# EAGLE design console (EAGLE 8.0.2)
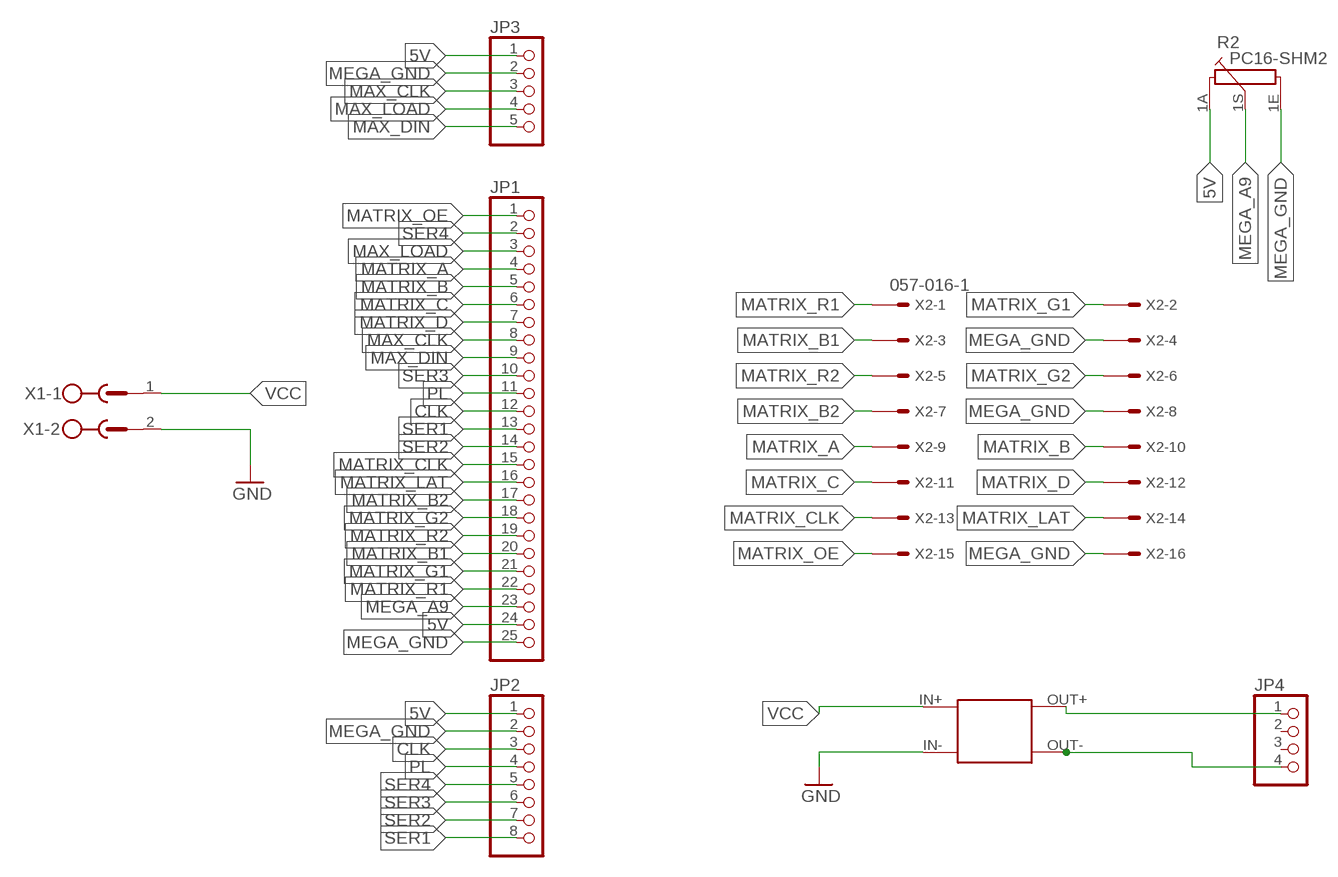
[diagram p0: schematic, sheet 1]

## Parts
JP1  PINHD-1X25  [1X25]
JP2  PINHD-1X8  [1X08]
JP3  PINHD-1X5  [1X05]
JP4  PINHD-1X4  [1X04]
R2  PC16-SHM2  [PC16-SHM2]
U$1  SPGRGL_DEV  [SPGRGL_PACK]
X1  MSTBV2  [MSTBV2]
X2  057-016-1  [057-016-1]

## Nets
5V: JP1.24 JP2.1 JP3.1 R2.1A
CLK: JP1.12 JP2.3
GND: U$1.IN- X1.2
MATRIX_A: JP1.4 X2.9
MATRIX_B: JP1.5 X2.10
MATRIX_B1: JP1.20 X2.3
MATRIX_B2: JP1.17 X2.7
MATRIX_C: JP1.6 X2.11
MATRIX_CLK: JP1.15 X2.13
MATRIX_D: JP1.7 X2.12
MATRIX_G1: JP1.21 X2.2
MATRIX_G2: JP1.18 X2.6
MATRIX_GND: JP4.4 U$1.OUT-
MATRIX_LAT: JP1.16 X2.14
MATRIX_OE: JP1.1 X2.15
MATRIX_R1: JP1.22 X2.1
MATRIX_R2: JP1.19 X2.5
MATRIX_VCC: JP4.1 U$1.OUT+
MAX_CLK: JP1.8 JP3.3
MAX_DIN: JP1.9 JP3.5
MAX_LOAD: JP1.3 JP3.4
MEGA_A9: JP1.23 R2.1S
MEGA_GND: JP1.25 JP2.2 JP3.2 R2.1E X2.4 X2.8 X2.16
PL: JP1.11 JP2.4
SER1: JP1.13 JP2.8
SER2: JP1.14 JP2.7
SER3: JP1.10 JP2.6
SER4: JP1.2 JP2.5
VCC: U$1.IN+ X1.1
Unconnected: JP4.2 JP4.3 R2.M1 R2.M2 R2.M3 R2.M4

## Library data of the parts
JP1 = pinhead:PINHD-1X25: PIN HEADER
JP2 = pinhead:PINHD-1X8: PIN HEADER
JP3 = pinhead:PINHD-1X5: PIN HEADER
JP4 = pinhead:PINHD-1X4: PIN HEADER
R2 = piher:PC16-SHM2: POTENTIOMETER single carbon potentiometer, 16 mm, S3ROH; OC_FARNELL: unknown; OC_NEWARK: unknown
U$1 = Spannungsregler:SPGRGL_DEV
X1 = con-phoenix-500:MSTBV2: PHOENIX; OC_FARNELL: unknown; OC_NEWARK: unknown
X2 = con-panduit:057-016-: CONNECTOR 10-pin series 057 contact pc board low profile headers; OC_FARNELL: unknown; OC_NEWARK: unknown

## Board
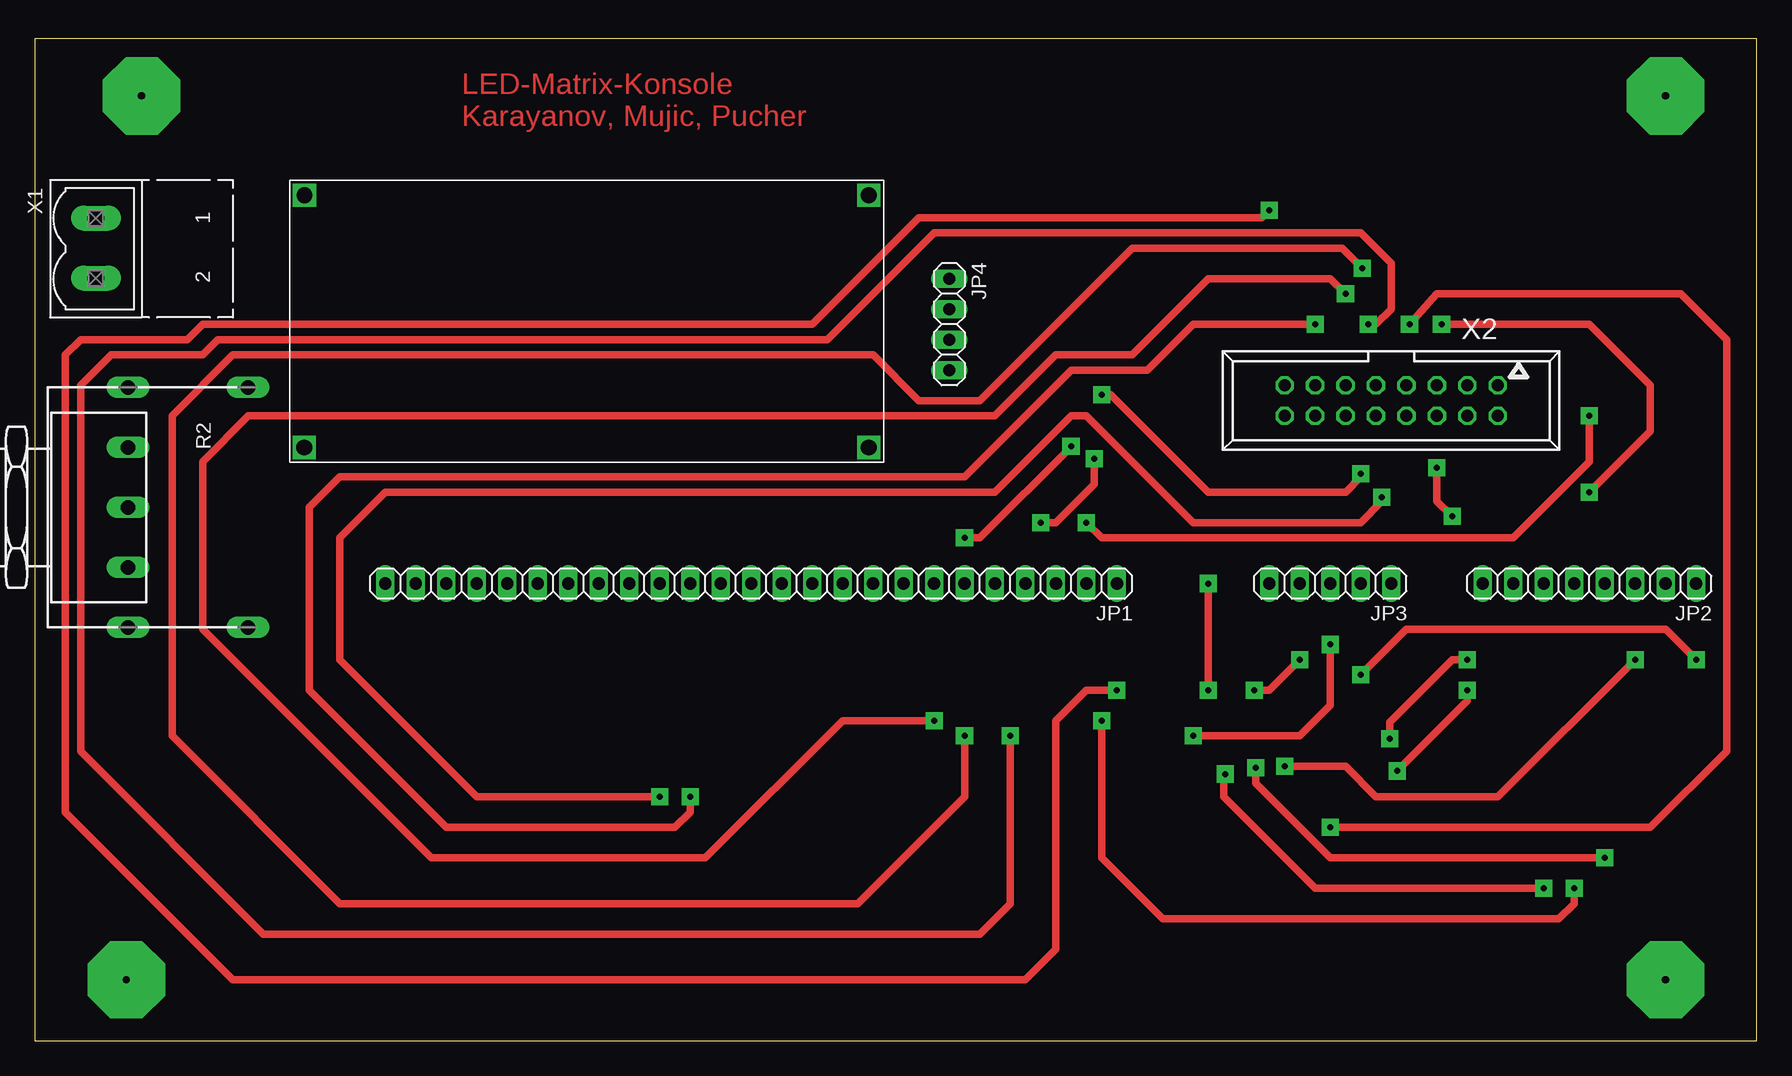
[diagram p1: board, top side]
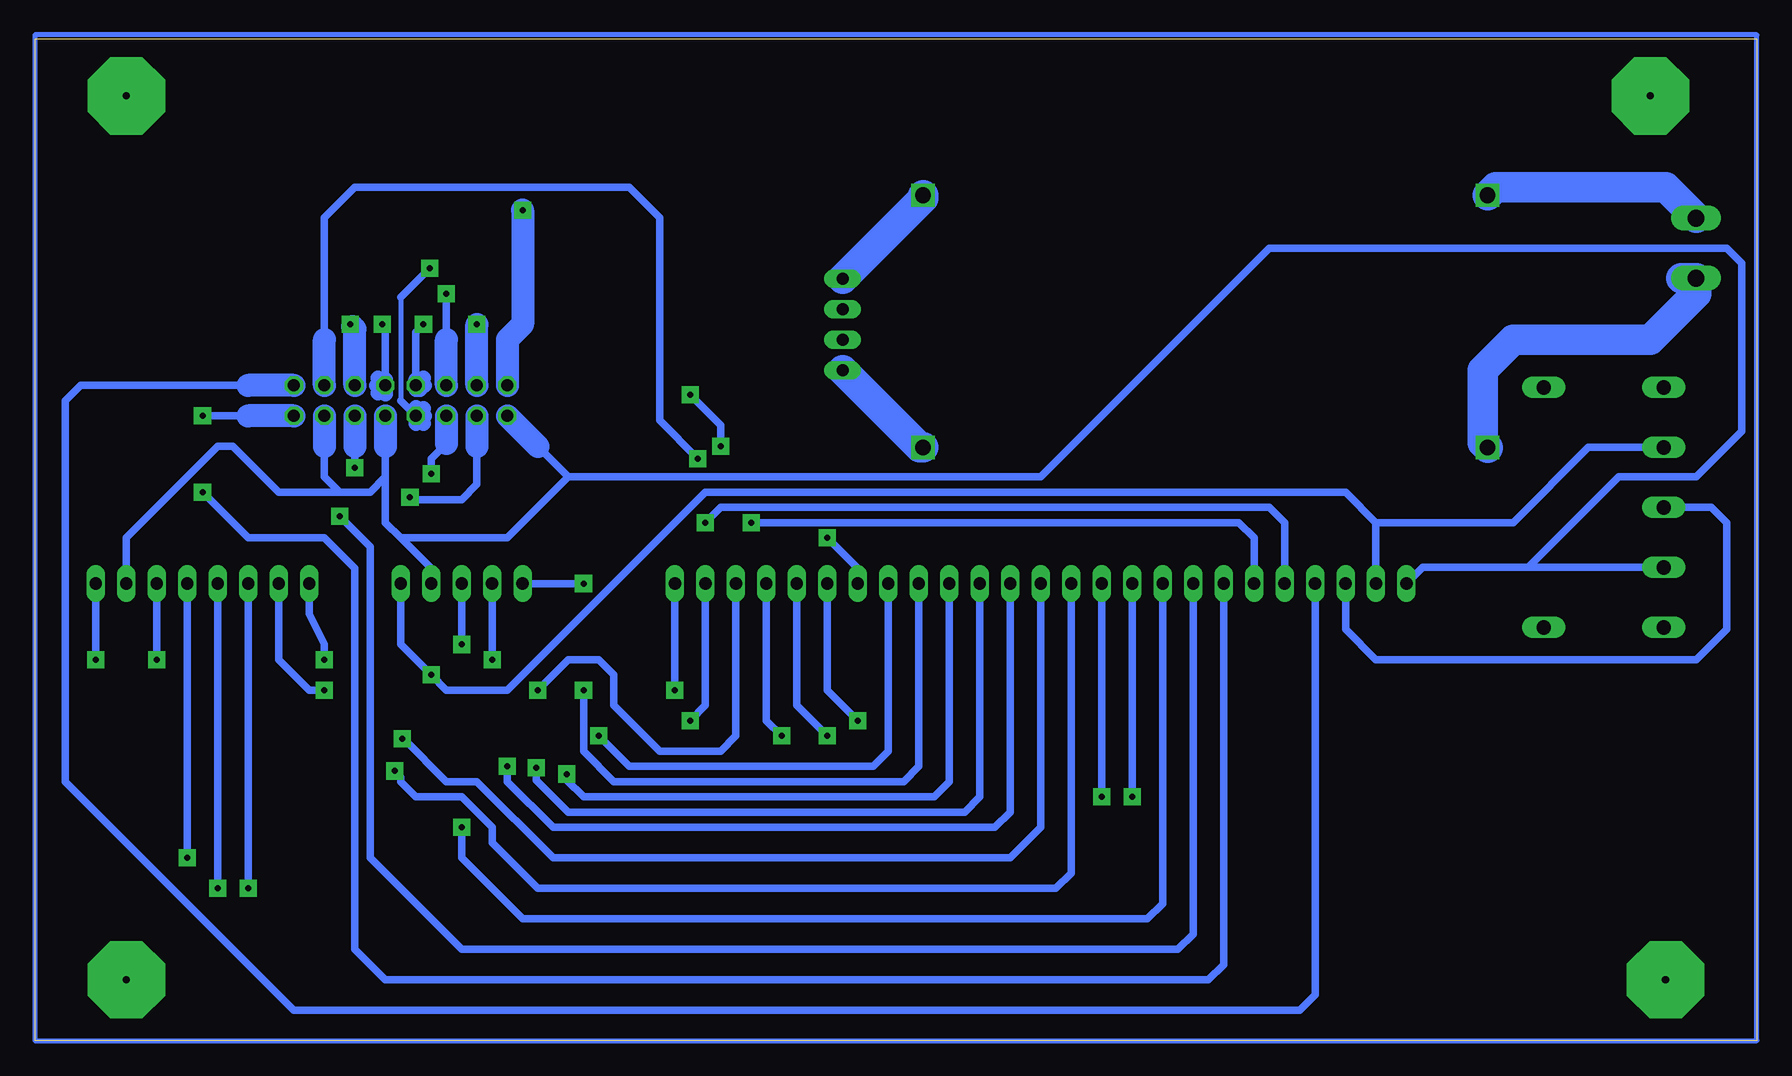
[diagram p2: board, bottom side, seen from below]

Size 143.49 x 83.49 mm. Coordinates in mm from the lower left corner, seen from the top.
Outline: 0,0 143.49,0 143.49,83.49 0,83.49 0,0
Copper layers (1*16): Top 0.035mm / dielectric 1.5mm / Bottom 0.035mm
Design rules "default": minimum track width 10mil, minimum drill 24mil, track to track 8mil, track to pad 8mil, pad to pad 8mil, via to via 8mil, smd to smd 8mil, copper to edge 40mil, drill to drill 8mil, minimum pad ring 10mil, minimum via ring 8mil, stop-mask expansion 4mil, vias tented up to drill 0mil, thermal gap 10mil

### Footprints (pad centres in the part's own frame; a part is rotated, then mirrored left to right if it is on the bottom)
1X25 = drill 1.016 long: 1 -29.21,0; 2 -26.67,0; 3 -24.13,0; 4 -21.59,0; 5 -19.05,0; 6 -16.51,0; 7 -13.97,0; 8 -11.43,0; 9 -8.89,0; 10 -6.35,0; 11 -3.81,0; 12 -1.27,0; 13 1.27,0; 14 3.81,0; 15 6.35,0; 16 8.89,0; 17 11.43,0; 18 13.97,0; 19 16.51,0; 20 19.05,0; 21 21.59,0; 22 24.13,0; 23 26.67,0; 24 29.21,0; 25 31.75,0
1X08 = drill 1.016 long: 1 -8.89,0; 2 -6.35,0; 3 -3.81,0; 4 -1.27,0; 5 1.27,0; 6 3.81,0; 7 6.35,0; 8 8.89,0
1X05 = drill 1.016 long: 1 -5.08,0; 2 -2.54,0; 3 0,0; 4 2.54,0; 5 5.08,0
1X04 = drill 1.016 long: 1 -3.81,0; 2 -1.27,0; 3 1.27,0; 4 3.81,0
PC16-SHM2 = drill 1.2 long: 1A -5,6.5; 1E 5,6.5; 1S 0,6.5; M1 -10,6.5; M2 10,6.5; M3 10,16.5; M4 -10,16.5
SPGRGL_PACK = drill 1.3 square: IN+ -23.262,10.762; IN- -23.27,-10.262; OUT+ 23.77,10.762; OUT- 23.77,-10.254
MSTBV2 = drill 1.397 long: 1 -2.5,0; 2 2.5,0
057-016-1 = drill 1 octagon: 1 -8.89,-1.27; 2 -8.89,1.27; 3 -6.35,-1.27; 4 -6.35,1.27; 5 -3.81,-1.27; 6 -3.81,1.27; 7 -1.27,-1.27; 8 -1.27,1.27; 9 1.27,-1.27; 10 1.27,1.27; 11 3.81,-1.27; 12 3.81,1.27; 13 6.35,-1.27; 14 6.35,1.27; 15 8.89,-1.27; 16 8.89,1.27

### Placement (x,y rotation side)
JP1  60.96,38.1 180 top
JP2  129.54,38.1 180 top
JP3  107.95,38.1 180 top
JP4  76.2,59.69 270 top
R2  1.27,44.45 270 top
U$1  45.72,59.69 0 top
X1  5.08,66.04 270 top
X2  113.03,53.34 180 top

### Tracks (layer width: path | path; a pad name or v marks a point on that pad's centre or on a via)
5V  (via drill 0.5 pad 1.42)
  Top 0.61: v110.49,30.48 114.3,34.29 135.89,34.29 v138.43,31.75
  Bottom 0.61: 31.75,43.18 JP1.24 | 31.75,43.18 34.29,45.72 87.63,45.72 104.14,29.21 109.22,29.21 v110.49,30.48 113.03,33.02 JP3.1 | v138.43,31.75 JP2.1 | 31.75,43.18 20.32,43.18 14.05,49.45 R2.1A
CLK  (via drill 0.5 pad 1.42)
  Top 0.61: v133.35,31.75 121.92,20.32 111.76,20.32 109.22,22.86 v104.14,22.86
  Bottom 0.61: v133.35,31.75 JP2.3 | JP1.12 62.23,19.05 63.5,17.78 100.33,17.78 104.14,21.59 v104.14,22.86
GND
  Bottom 0.61: U$1.IN- 22.35,49.53
  Bottom 2.54: 6.31,63.54 X1.2 5.08,62.23 8.89,58.42 20.32,58.42 22.86,55.88 22.86,49.84 U$1.IN-
MATRIX_A  (via drill 0.5 pad 1.42)
  Top 0.61: v111.12,59.69 111.76,59.69 113.03,60.96 113.03,64.77 110.49,67.31 74.93,67.31 66.04,58.42 15.24,58.42 13.97,57.15 6.35,57.15 3.81,54.61 3.81,24.13 19.05,8.89 78.74,8.89 81.28,11.43 v81.28,25.4
  Bottom 0.61: v111.12,59.69 111.76,59.05 111.76,55.12 | v81.28,25.4 82.55,26.67 JP1.4
  Bottom 1.27: X2.9 | X2.9 111.76,55.12 | 111.02,54.61 X2.9 | 111.76,54.25 X2.9 | X2.9 111.4,54.25 | X2.9 111.12,55.24
MATRIX_B  (via drill 0.5 pad 1.42)
  Top 0.61: v110.62,64.39 108.97,66.04 91.44,66.04 78.74,53.34 73.66,53.34 69.85,57.15 16.51,57.15 11.43,52.07 11.43,25.4 25.4,11.43 68.58,11.43 77.47,20.32 v77.47,25.4
  Bottom 0.406: 113.03,61.98 113.03,53.34
  Bottom 0.61: v77.47,25.4 80.01,27.94 JP1.5 | v110.62,64.39 113.03,61.98 | 113.03,53.34 X2.10
  Bottom 1.27: 111.76,52.78 X2.10 | X2.10 111.02,52.07 | X2.10 111.76,51.44 | X2.10 111.12,51.44 | X2.10 111.12,52.7
MATRIX_B1  (via drill 0.5 pad 1.42)
  Top 0.61: v83.82,43.18 85.09,43.18 88.27,46.36 v88.27,48.51
  Bottom 0.61: JP1.20 41.91,41.91 43.18,43.18 v83.82,43.18 | 119.38,58.42 119.38,68.58 116.84,71.12 93.98,71.12 91.44,68.58 91.44,51.69 v88.27,48.51
  Bottom 1.93: X2.3 119.38,58.42
MATRIX_B2  (via drill 0.5 pad 1.42)
  Top 0.61: v107.95,17.78 134.62,17.78 140.97,24.13 140.97,58.42 137.16,62.23 116.84,62.23 v114.55,59.69
  Bottom 0.61: JP1.17 49.53,11.43 50.8,10.16 102.87,10.16 107.95,15.24 v107.95,17.78 | v114.55,59.69 114.3,59.05 114.3,55.12
  Bottom 1.27: 114.3,55.12 X2.7 | X2.7 115.04,54.61 | X2.7 114.3,53.87 | X2.7 114.94,55.24 | X2.7 114.94,53.98
MATRIX_C  (via drill 0.5 pad 1.42)
  Top 0.61: v109.22,62.23 107.95,63.5 97.79,63.5 91.44,57.15 85.09,57.15 80.01,52.07 17.78,52.07 13.97,48.26 13.97,34.29 33.02,15.24 55.88,15.24 67.31,26.67 v74.93,26.67
  Bottom 0.61: JP1.6 77.47,29.21 v74.93,26.67 | 109.22,58.42 v109.22,62.23
  Bottom 1.93: X2.11 109.22,58.42
MATRIX_CLK  (via drill 0.5 pad 1.42)
  Top 0.61: v54.61,20.32 54.61,19.05 53.34,17.78 34.29,17.78 22.86,29.21 22.86,44.45 25.4,46.99 77.47,46.99 86.36,55.88 92.71,55.88 96.52,59.69 v106.68,59.69
  Bottom 0.61: JP1.15 v54.61,20.32
  Bottom 1.93: X2.13 v106.68,59.69
MATRIX_D  (via drill 0.5 pad 1.42)
  Top 0.61: v110.49,47.24 110.49,46.99 109.22,45.72 97.79,45.72 89.66,53.85 v88.9,53.85 | v86.34,49.53 86.34,49.52 78.74,41.91 v77.47,41.91
  Bottom 0.61: JP1.7 74.93,39.37 v77.47,41.91 | 109.22,49.78 110.49,48.51 v110.49,47.24 | v88.9,53.85 86.34,51.29 v86.34,49.53
  Bottom 1.93: X2.12 109.22,49.78
MATRIX_G1  (via drill 0.5 pad 1.42)
  Top 0.61: v129.54,52.07 129.54,48.26 123.19,41.91 88.9,41.91 v87.63,43.18
  Bottom 0.61: 125.73,52.07 v129.54,52.07 | JP1.21 39.37,43.18 40.64,44.45 86.36,44.45 v87.63,43.18
  Bottom 1.93: X2.2 125.73,52.07
MATRIX_G2  (via drill 0.5 pad 1.42)
  Top 0.61: v118.11,43.69 116.84,44.96 v116.84,47.75
  Bottom 0.61: JP1.18 46.99,8.89 48.26,7.62 107.95,7.62 115.57,15.24 115.57,41.15 v118.11,43.69 | 116.84,49.53 v116.84,47.75
  Bottom 1.93: X2.6 116.84,49.53
MATRIX_GND
  Bottom 2.54: U$1.OUT- 69.76,49.44 JP4.4
MATRIX_LAT  (via drill 0.5 pad 1.42)
  Top 0.61: v52.07,20.32 36.83,20.32 25.4,31.75 25.4,41.91 29.21,45.72 80.01,45.72 86.36,52.07 87.63,52.07 96.52,43.18 110.49,43.18 112.25,44.94 v112.25,45.28
  Bottom 0.61: JP1.16 v52.07,20.32 | 106.68,49.53 106.68,46.36 107.95,45.09 112.06,45.09 v112.25,45.28
  Bottom 1.93: X2.14 106.68,49.53
MATRIX_OE  (via drill 0.5 pad 1.42)
  Top 0.61: v90.17,29.21 87.63,29.21 85.09,26.67 85.09,7.62 82.55,5.08 16.51,5.08 2.54,19.05 2.54,57.15 3.81,58.42 12.7,58.42 13.97,59.69 64.77,59.69 73.66,68.58 102.23,68.58 v102.87,69.21
  Bottom 0.61: JP1.1 v90.17,29.21
  Bottom 1.93: X2.15 104.14,58.42 102.87,59.69 v102.87,69.21
MATRIX_R1
  Bottom 0.61: 125.73,54.61 139.7,54.61 140.97,53.34 140.97,21.59 121.92,2.54 38.1,2.54 36.83,3.81 JP1.22
  Bottom 1.93: X2.1 125.73,54.61
MATRIX_R2  (via drill 0.5 pad 1.42)
  Top 0.61: v129.54,45.72 134.62,50.8 134.62,54.61 129.54,59.69 v117.22,59.69
  Bottom 0.61: v129.54,45.72 125.73,41.91 119.38,41.91 116.84,39.37 116.84,7.62 114.3,5.08 45.72,5.08 44.45,6.35 JP1.19 | 117.03,59.5 v117.22,59.69
  Bottom 1.93: 117.03,59.5 116.84,59.31 X2.5
MATRIX_VCC
  Bottom 2.54: U$1.OUT+ 69.49,70.21 JP4.1
MAX_CLK  (via drill 0.5 pad 1.42)
  Top 0.61: v96.52,25.4 105.41,25.4 107.95,27.94 v107.95,33.02
  Bottom 0.61: v107.95,33.02 JP3.3 | v96.52,25.4 93.98,22.86 73.66,22.86 72.39,24.13 JP1.8
MAX_DIN  (via drill 0.5 pad 1.42)
  Top 0.61: v97.79,29.21 v97.79,38.1
  Bottom 0.61: v97.79,38.1 JP3.5 | JP1.9 69.85,22.86 71.12,21.59 95.25,21.59 97.79,24.13 v97.79,29.21
MAX_LOAD  (via drill 0.5 pad 1.42)
  Top 0.61: v101.6,29.21 102.87,29.21 v105.41,31.75
  Bottom 0.61: JP1.3 85.09,25.4 86.36,24.13 91.44,24.13 95.25,27.94 95.25,30.48 96.52,31.75 99.06,31.75 v101.6,29.21 | v105.41,31.75 JP3.4
MEGA_A9
  Bottom 0.61: R2.1S 3.81,44.45 2.54,43.18 2.54,34.29 5.08,31.75 31.75,31.75 34.29,34.29 JP1.23
MEGA_GND
  Bottom 0.61: 19.05,39.45 27.86,39.45 JP1.25 | 19.05,39.45 R2.1E 7.77,39.52 | JP2.2 135.89,41.91 128.27,49.53 127,49.53 123.19,45.72 118.11,45.72 | JP3.2 110.49,39.37 113.03,41.91 | 113.03,41.91 114.3,43.18 114.3,46.99 | 114.3,49.53 114.3,46.99 | 118.11,45.72 115.57,45.72 114.3,46.99 | 99.06,46.99 59.69,46.99 40.64,66.04 2.54,66.04 1.27,64.77 1.27,50.8 5.08,46.99 11.51,46.99 19.05,39.45 | 101.6,49.53 99.06,46.99 | 99.06,46.99 104.14,41.91 113.03,41.91 | 118.11,45.72 119.38,46.99 119.38,49.53
  Bottom 1.93: X2.8 114.3,49.53 | X2.4 119.38,49.53 | X2.16 101.6,49.53
N$1
  Bottom 0.406: 0,83.82 143.51,83.82 143.51,0 0,0 0,83.82
N$3  (via drill 0.6 pad 6.45)
  other vias: 8.89,78.74
N$4  (via drill 0.6 pad 6.45)
  other vias: 7.62,5.08
N$5  (via drill 0.6 pad 6.45)
  other vias: 135.89,78.74
N$6  (via drill 0.6 pad 6.45)
  other vias: 135.89,5.08
PL  (via drill 0.5 pad 1.42)
  Top 0.61: v130.81,15.24 107.95,15.24 101.73,21.46 v101.73,22.73
  Bottom 0.61: v130.81,15.24 JP2.4 | JP1.11 64.77,20.32 66.04,19.05 99.06,19.05 101.73,21.72 v101.73,22.73
SER1  (via drill 0.5 pad 1.42)
  Top 0.61: v119.38,31.75 118.11,31.75 112.9,26.54 v112.9,25.15
  Bottom 0.61: JP1.13 59.69,17.78 62.23,15.24 100.33,15.24 106.68,21.59 109.22,21.59 112.78,25.15 v112.9,25.15 | v119.38,31.75 119.38,33.02 120.65,35.56 JP2.8
SER2  (via drill 0.5 pad 1.42)
  Top 0.61: v113.54,22.48 119.38,28.32 v119.38,29.21
  Bottom 0.61: JP1.14 57.15,13.97 58.42,12.7 101.6,12.7 105.41,16.51 105.41,17.78 107.95,20.32 111.76,20.32 113.03,21.59 113.03,21.97 v113.54,22.48 | v119.38,29.21 120.65,29.21 123.19,31.75 JP2.7
SER3  (via drill 0.5 pad 1.42)
  Top 0.61: v125.73,12.7 106.68,12.7 99.06,20.32 99.06,21.59 99.19,21.72 v99.19,22.23
  Bottom 0.61: v125.73,12.7 JP2.6 | JP1.10 67.31,21.59 68.58,20.32 97.79,20.32 99.19,21.72 v99.19,22.23
SER4  (via drill 0.5 pad 1.42)
  Top 0.61: v88.9,26.67 88.9,15.24 93.98,10.16 127,10.16 128.27,11.43 v128.27,12.7
  Bottom 0.61: JP1.2 87.63,27.94 v88.9,26.67 | v128.27,12.7 JP2.5
VCC
  Bottom 0.61: X1.1 5.08,68.58
  Bottom 2.54: 5.08,68.58 7.62,71.12 21.79,71.12 U$1.IN+

### Text on the board
Top: LED-Matrix-Konsole / Karayanov, Mujic, Pucher